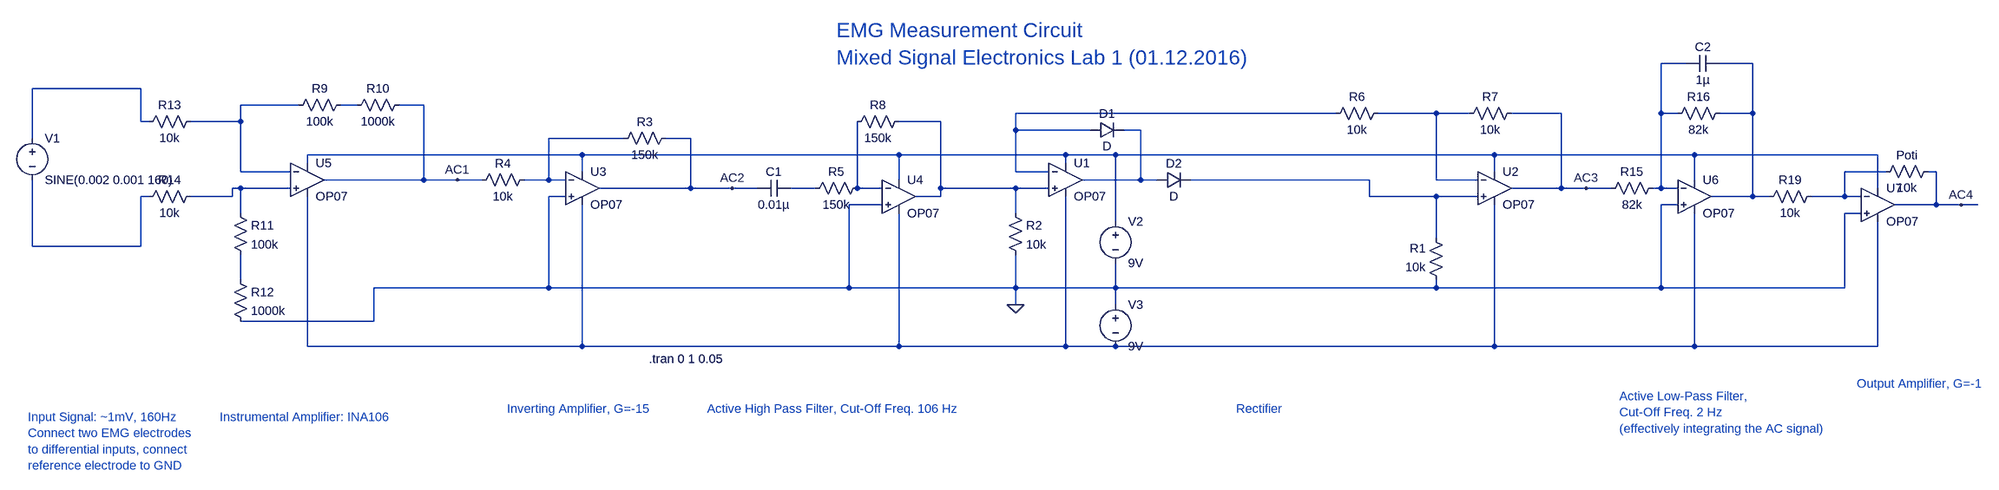
[diagram p0: schematic 161201_Lab1_EMG.asc]
161201_Lab1_EMG.asc, the LTspice schematic file:
Version 4
SHEET 1 2264 716
WIRE 1376 -64 1328 -64
WIRE 1504 -64 1440 -64
WIRE -1600 -16 -1808 -16
WIRE -1296 16 -1408 16
WIRE -1184 16 -1216 16
WIRE -1056 16 -1104 16
WIRE 704 32 80 32
WIRE 896 32 784 32
WIRE 960 32 896 32
WIRE 1136 32 1040 32
WIRE 1328 32 1328 -64
WIRE 1360 32 1328 32
WIRE 1504 32 1504 -64
WIRE 1504 32 1440 32
WIRE -1600 48 -1600 -16
WIRE -1584 48 -1600 48
WIRE -1408 48 -1408 16
WIRE -1408 48 -1504 48
WIRE -64 48 -144 48
WIRE 80 64 80 32
WIRE 224 64 80 64
WIRE 320 64 288 64
WIRE -1808 80 -1808 -16
WIRE -672 80 -816 80
WIRE -544 80 -592 80
WIRE -752 112 -1280 112
WIRE -144 112 -752 112
WIRE 176 112 -144 112
WIRE 272 112 176 112
WIRE 1008 112 272 112
WIRE 1392 112 1008 112
WIRE 1744 112 1392 112
WIRE -1280 128 -1280 112
WIRE 176 128 176 112
WIRE -1408 144 -1408 48
WIRE -1312 144 -1408 144
WIRE -752 144 -752 112
WIRE 80 144 80 64
WIRE 144 144 80 144
WIRE 1008 144 1008 112
WIRE 1760 144 1680 144
WIRE 1856 144 1840 144
WIRE -1056 160 -1056 16
WIRE -1056 160 -1248 160
WIRE -992 160 -1056 160
WIRE -944 160 -992 160
WIRE -816 160 -816 80
WIRE -816 160 -864 160
WIRE -784 160 -816 160
WIRE -144 160 -144 112
WIRE 320 160 320 64
WIRE 320 160 208 160
WIRE 352 160 320 160
WIRE 768 160 416 160
WIRE 896 160 896 32
WIRE 976 160 896 160
WIRE 1392 160 1392 112
WIRE -1408 176 -1424 176
WIRE -1312 176 -1408 176
WIRE -544 176 -544 80
WIRE -544 176 -720 176
WIRE -464 176 -544 176
WIRE -416 176 -464 176
WIRE -304 176 -352 176
WIRE -224 176 -224 48
WIRE -176 176 -224 176
WIRE -64 176 -64 48
WIRE 80 176 -64 176
WIRE 144 176 80 176
WIRE 1136 176 1136 32
WIRE 1136 176 1040 176
WIRE 1184 176 1136 176
WIRE 1232 176 1184 176
WIRE 1328 176 1328 32
WIRE 1328 176 1312 176
WIRE 1360 176 1328 176
WIRE 1744 176 1744 112
WIRE -1584 192 -1600 192
WIRE -1424 192 -1424 176
WIRE -1424 192 -1504 192
WIRE -784 192 -816 192
WIRE -64 192 -64 176
WIRE -64 192 -112 192
WIRE 768 192 768 160
WIRE 896 192 768 192
WIRE 976 192 896 192
WIRE 1504 192 1504 32
WIRE 1504 192 1424 192
WIRE 1536 192 1504 192
WIRE 1680 192 1680 144
WIRE 1680 192 1616 192
WIRE 1712 192 1680 192
WIRE -176 208 -240 208
WIRE 1360 208 1328 208
WIRE 1856 208 1856 144
WIRE 1856 208 1776 208
WIRE 1904 208 1856 208
WIRE 1936 208 1904 208
WIRE -1408 224 -1408 176
WIRE 80 224 80 176
WIRE 1712 224 1680 224
WIRE 272 240 272 112
WIRE 896 272 896 192
WIRE -1808 288 -1808 160
WIRE -1600 288 -1600 192
WIRE -1600 288 -1808 288
WIRE -1408 352 -1408 304
WIRE -816 368 -816 192
WIRE -816 368 -1152 368
WIRE -240 368 -240 208
WIRE -240 368 -816 368
WIRE 80 368 80 304
WIRE 80 368 -240 368
WIRE 272 368 272 320
WIRE 272 368 80 368
WIRE 896 368 896 352
WIRE 896 368 272 368
WIRE 1328 368 1328 208
WIRE 1328 368 896 368
WIRE 1680 368 1680 224
WIRE 1680 368 1328 368
WIRE 80 400 80 368
WIRE 272 400 272 368
WIRE -1152 432 -1152 368
WIRE -1152 432 -1408 432
WIRE -1280 480 -1280 192
WIRE -752 480 -752 208
WIRE -752 480 -1280 480
WIRE -144 480 -144 224
WIRE -144 480 -752 480
WIRE 176 480 176 192
WIRE 176 480 -144 480
WIRE 272 480 176 480
WIRE 1008 480 1008 208
WIRE 1008 480 272 480
WIRE 1392 480 1392 224
WIRE 1392 480 1008 480
WIRE 1744 480 1744 240
WIRE 1744 480 1392 480
FLAG 80 400 0
FLAG -992 160 AC1
FLAG -464 176 AC2
FLAG 1184 176 AC3
FLAG 1904 208 AC4
SYMBOL Opamps\\OP07 176 96 R0
SYMATTR InstName U1
SYMBOL res 64 208 R0
SYMATTR InstName R2
SYMATTR Value 10k
SYMBOL diode 224 80 R270
WINDOW 0 32 32 VTop 2
WINDOW 3 0 32 VBottom 2
SYMATTR InstName D1
SYMBOL diode 352 176 R270
WINDOW 0 32 32 VTop 2
WINDOW 3 0 32 VBottom 2
SYMATTR InstName D2
SYMBOL voltage 272 224 R0
WINDOW 123 0 0 Left 2
WINDOW 39 0 0 Left 2
SYMATTR InstName V2
SYMATTR Value 9V
SYMBOL voltage 272 384 R0
WINDOW 123 0 0 Left 2
WINDOW 39 0 0 Left 2
SYMATTR InstName V3
SYMATTR Value 9V
SYMBOL res 800 16 R90
WINDOW 0 0 56 VBottom 2
WINDOW 3 32 56 VTop 2
SYMATTR InstName R6
SYMATTR Value 10k
SYMBOL Opamps\\OP07 1008 112 R0
SYMATTR InstName U2
SYMBOL res 1056 16 R90
WINDOW 0 0 56 VBottom 2
WINDOW 3 32 56 VTop 2
SYMATTR InstName R7
SYMATTR Value 10k
SYMBOL res 912 368 R180
WINDOW 0 36 76 Left 2
WINDOW 3 36 40 Left 2
SYMATTR InstName R1
SYMATTR Value 10k
SYMBOL Opamps\\OP07 -752 112 R0
SYMATTR InstName U3
SYMBOL res -688 96 R270
WINDOW 0 32 56 VTop 2
WINDOW 3 0 56 VBottom 2
SYMATTR InstName R3
SYMATTR Value 150k
SYMBOL res -960 176 R270
WINDOW 0 32 56 VTop 2
WINDOW 3 0 56 VBottom 2
SYMATTR InstName R4
SYMATTR Value 10k
SYMBOL cap -352 160 R90
WINDOW 0 0 32 VBottom 2
WINDOW 3 32 32 VTop 2
SYMATTR InstName C1
SYMATTR Value 0.01µ
SYMBOL Opamps\\OP07 -144 128 R0
SYMATTR InstName U4
SYMBOL res -320 192 R270
WINDOW 0 32 56 VTop 2
WINDOW 3 0 56 VBottom 2
SYMATTR InstName R5
SYMATTR Value 150k
SYMBOL res -240 64 R270
WINDOW 0 32 56 VTop 2
WINDOW 3 0 56 VBottom 2
SYMATTR InstName R8
SYMATTR Value 150k
SYMBOL Opamps\\OP07 -1280 96 R0
SYMATTR InstName U5
SYMBOL res -1312 32 R270
WINDOW 0 32 56 VTop 2
WINDOW 3 0 56 VBottom 2
SYMATTR InstName R9
SYMATTR Value 100k
SYMBOL res -1200 32 R270
WINDOW 0 32 56 VTop 2
WINDOW 3 0 56 VBottom 2
SYMATTR InstName R10
SYMATTR Value 1000k
SYMBOL res -1424 208 R0
SYMATTR InstName R11
SYMATTR Value 100k
SYMBOL res -1424 336 R0
SYMATTR InstName R12
SYMATTR Value 1000k
SYMBOL res -1600 64 R270
WINDOW 0 32 56 VTop 2
WINDOW 3 0 56 VBottom 2
SYMATTR InstName R13
SYMATTR Value 10k
SYMBOL res -1600 208 R270
WINDOW 0 32 56 VTop 2
WINDOW 3 0 56 VBottom 2
SYMATTR InstName R14
SYMATTR Value 10k
SYMBOL Opamps\\OP07 1392 128 R0
SYMATTR InstName U6
SYMBOL res 1328 160 R90
WINDOW 0 0 56 VBottom 2
WINDOW 3 32 56 VTop 2
SYMATTR InstName R15
SYMATTR Value 82k
SYMBOL res 1456 16 R90
WINDOW 0 0 56 VBottom 2
WINDOW 3 32 56 VTop 2
SYMATTR InstName R16
SYMATTR Value 82k
SYMBOL cap 1440 -80 R90
WINDOW 0 0 32 VBottom 2
WINDOW 3 32 32 VTop 2
SYMATTR InstName C2
SYMATTR Value 1µ
SYMBOL Opamps\\OP07 1744 144 R0
SYMATTR InstName U7
SYMBOL res 1856 128 R90
WINDOW 0 0 56 VBottom 2
WINDOW 3 32 56 VTop 2
SYMATTR InstName Poti
SYMATTR Value 10k
SYMBOL res 1632 176 R90
WINDOW 0 0 56 VBottom 2
WINDOW 3 32 56 VTop 2
SYMATTR InstName R19
SYMATTR Value 10k
SYMBOL voltage -1808 64 R0
WINDOW 123 0 0 Left 2
WINDOW 39 0 0 Left 2
SYMATTR InstName V1
SYMATTR Value SINE(0.002 0.001 160)
TEXT -624 504 Left 2 !.tran 0 1 0.05
TEXT -1816 616 Left 2 ;Input Signal: ~1mV, 160Hz\nConnect two EMG electrodes\nto differential inputs, connect\nreference electrode to GND
TEXT -1448 616 Left 2 ;Instrumental Amplifier: INA106
TEXT -896 600 Left 2 ;Inverting Amplifier, G=-15
TEXT -512 600 Left 2 ;Active High Pass Filter, Cut-Off Freq. 106 Hz
TEXT 504 600 Left 2 ;Rectifier
TEXT 1248 576 Left 2 ;Active Low-Pass Filter,\nCut-Off Freq. 2 Hz\n(effectively integrating the AC signal)
TEXT 1704 552 Left 2 ;Output Amplifier, G=-1
TEXT -264 -128 Left 4 ;EMG Measurement Circuit\nMixed Signal Electronics Lab 1 (01.12.2016)

The netlist it stands for:
* 161201_Lab1_EMG.asc
XU1 N008 N006 N011 N019 N009 LT1001  ; OP07, pins In+ In- V+ V- OUT
R2 N008 0 10k
D1 N006 N009 D
D2 N009 N013 D
V2 N011 0 9V
V3 0 N019 9V
R6 N007 N006 10k
XU2 N013 N007 N011 N019 AC3 LT1001  ; OP07, pins In+ In- V+ V- OUT
R7 AC3 N007 10k
R1 0 N013 10k
XU3 0 N010 N011 N019 AC2 LT1001  ; OP07, pins In+ In- V+ V- OUT
R3 N010 AC2 150k
R4 AC1 N010 10k
C1 N015 AC2 0.01µ
XU4 0 N016 N011 N019 N008 LT1001  ; OP07, pins In+ In- V+ V- OUT
R5 N015 N016 150k
R8 N016 N008 150k
XU5 N014 N004 N011 N019 AC1 LT1001  ; OP07, pins In+ In- V+ V- OUT
R9 N004 N005 100k
R10 N005 AC1 1000k
R11 N014 N018 100k
R12 N018 0 1000k
R13 N003 N004 10k
R14 N017 N014 10k
XU6 0 N001 N011 N019 N002 LT1001  ; OP07, pins In+ In- V+ V- OUT
R15 N001 AC3 82k
R16 N002 N001 82k
C2 N002 N001 1µ
XU7 0 N012 N011 N019 AC4 LT1001  ; OP07, pins In+ In- V+ V- OUT
R§Poti AC4 N012 10k
R19 N012 N002 10k
V1 N003 N017 SINE(0.002 0.001 160)
.model D D
.lib standard.dio
.tran 0 1 0.05
* Input Signal: ~1mV, 160Hz
* Connect two EMG electrodes
* to differential inputs, connect
* reference electrode to GND
* Instrumental Amplifier: INA106
* Inverting Amplifier, G=-15
* Active High Pass Filter, Cut-Off Freq. 106 Hz
* Rectifier
* Active Low-Pass Filter,
* Cut-Off Freq. 2 Hz
* (effectively integrating the AC signal)
* Output Amplifier, G=-1
* EMG Measurement Circuit
* Mixed Signal Electronics Lab 1 (01.12.2016)
.lib LTC.lib
.backanno
.end